# Altium schematic sheet Current_Sense_Amp.SchDoc
size A4; Organization: TESLA Motors, INC; Address1: 3500 Deer Creek Road; Address2: Palo Alto, CA; Address4: U.S.A.; SheetNumber: 10; SheetTotal: 11
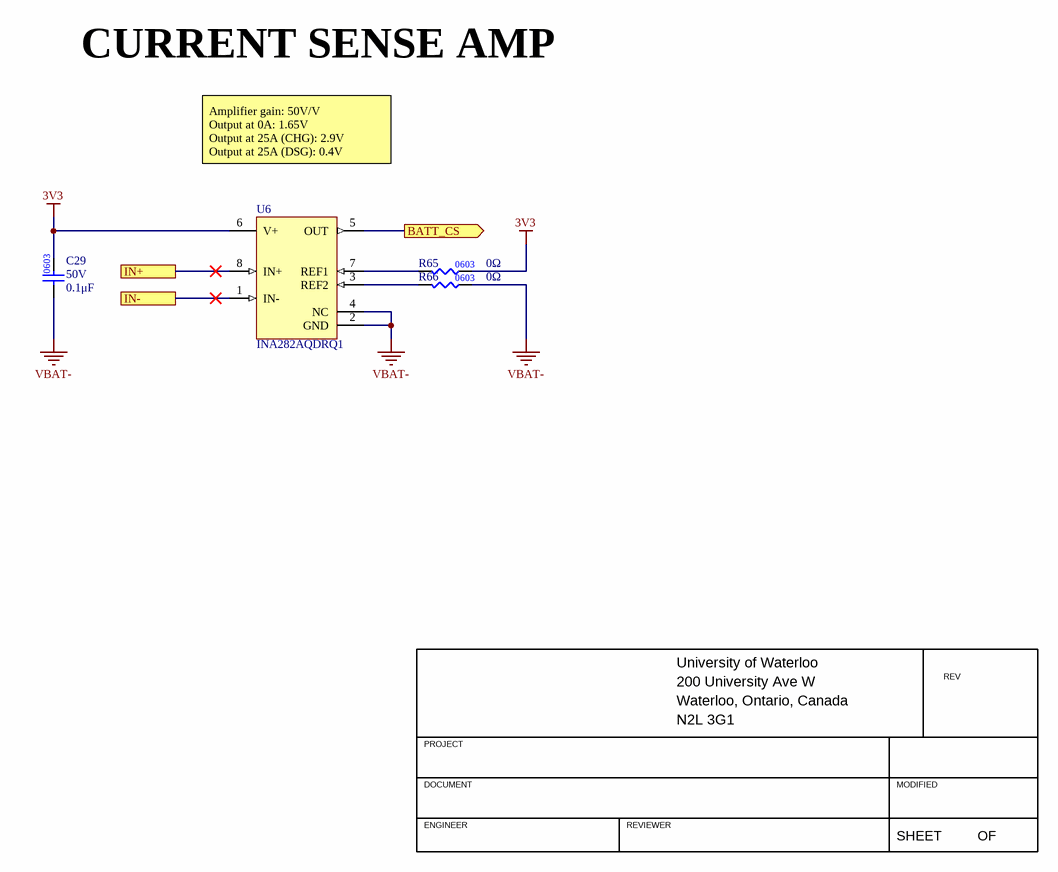
[diagram p0: Current_Sense_Amp.SchDoc]

## Parts
C29  value 0.1μF  Voltage Rating: 50V  [CAP0603]  (hidden comment: CAP_0.1uF_50V_0603)
R65  value 0Ω  [RES0603]  (hidden comment: RES_0Ω_0603)
R66  value 0Ω  [RES0603]  (hidden comment: RES_0Ω_0603)
U6  INA282AQDRQ1  [8-SOIC_M]

## Ports
BATT_CS (out), IN+, IN-

## Nets
3V3: C29.2 R65.2 U6.6(V+)
VBAT-: C29.1 R66.2 U6.2(GND) U6.4(NC)
BATT_CS: U6.5(OUT) ; port BATT_CS
IN+: U6.8(IN+) ; port IN+
IN-: U6.1(IN-) ; port IN-
NetR65_1: R65.1 U6.7(REF1)
NetR66_1: R66.1 U6.3(REF2)

## Notes on the sheet
- CURRENT SENSE AMP
- Amplifier gain: 50V/V
  Output at 0A: 1.65V
  Output at 25A (CHG): 2.9V
  Output at 25A (DSG): 0.4V
- University of Waterloo
- 200 University Ave W
- REV
- PROJECT
- Waterloo, Ontario, Canada
- N2L 3G1
- DOCUMENT
- ENGINEER
- REVIEWER
- MODIFIED
- SHEET
- OF

## Library data of the parts
C29 = CAP_0.1uF_50V_0603: CAP CER 0.1UF 50V X7R 0603; Manufacturer Part Number 1: CC0603KRX7R9BB104; Manufacturer 1: Yageo; Package/Footprint: 0603; Supplier Part Number 1: 311-1344-1-ND; Supplier 1: Digi-Key; Mounting Type: SMD; Dielectric: X7R
R65 R66 = RES_0Ω_0603: RES 0 OHM JUMPER 1/10W 0603; Manufacturer 1: Yageo; Manufacturer Part Number 1: RC0603JR-070RL; Supplier Part Number 1: 311-0.0GRCT-ND; Supplier 1: Digi-Key; Mounting Type: SMD; Package: 0603
U6 = INA282AQDRQ1: IC CURRENT MONITOR 0.4% 8SOIC; Manufacturer 1: Texas Instruments; Package/Footprint: 8-SOIC; Supplier 1: Digi-Key; Supplier Part Number 1: 296-36595-1-ND; Manufacturer Part Number 1: INA282AQDRQ1